# EAGLE schematic mr_radar (EAGLE 5.11)
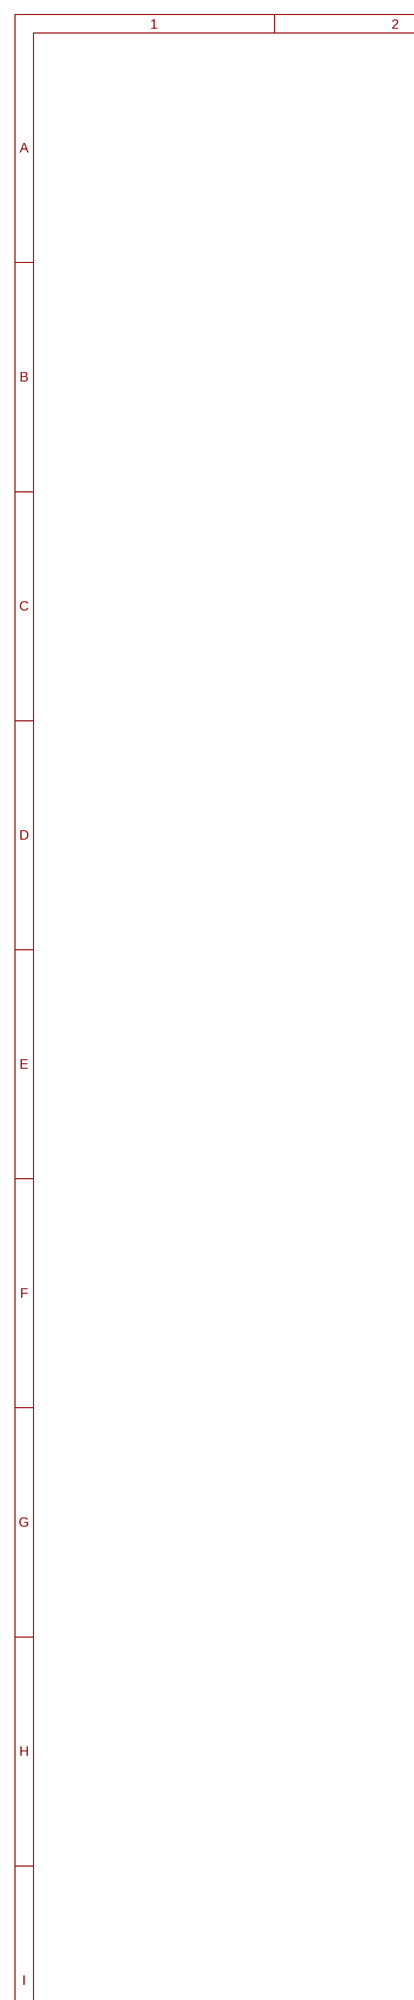
[diagram p0: schematic, sheet 1, part 1 of 2]
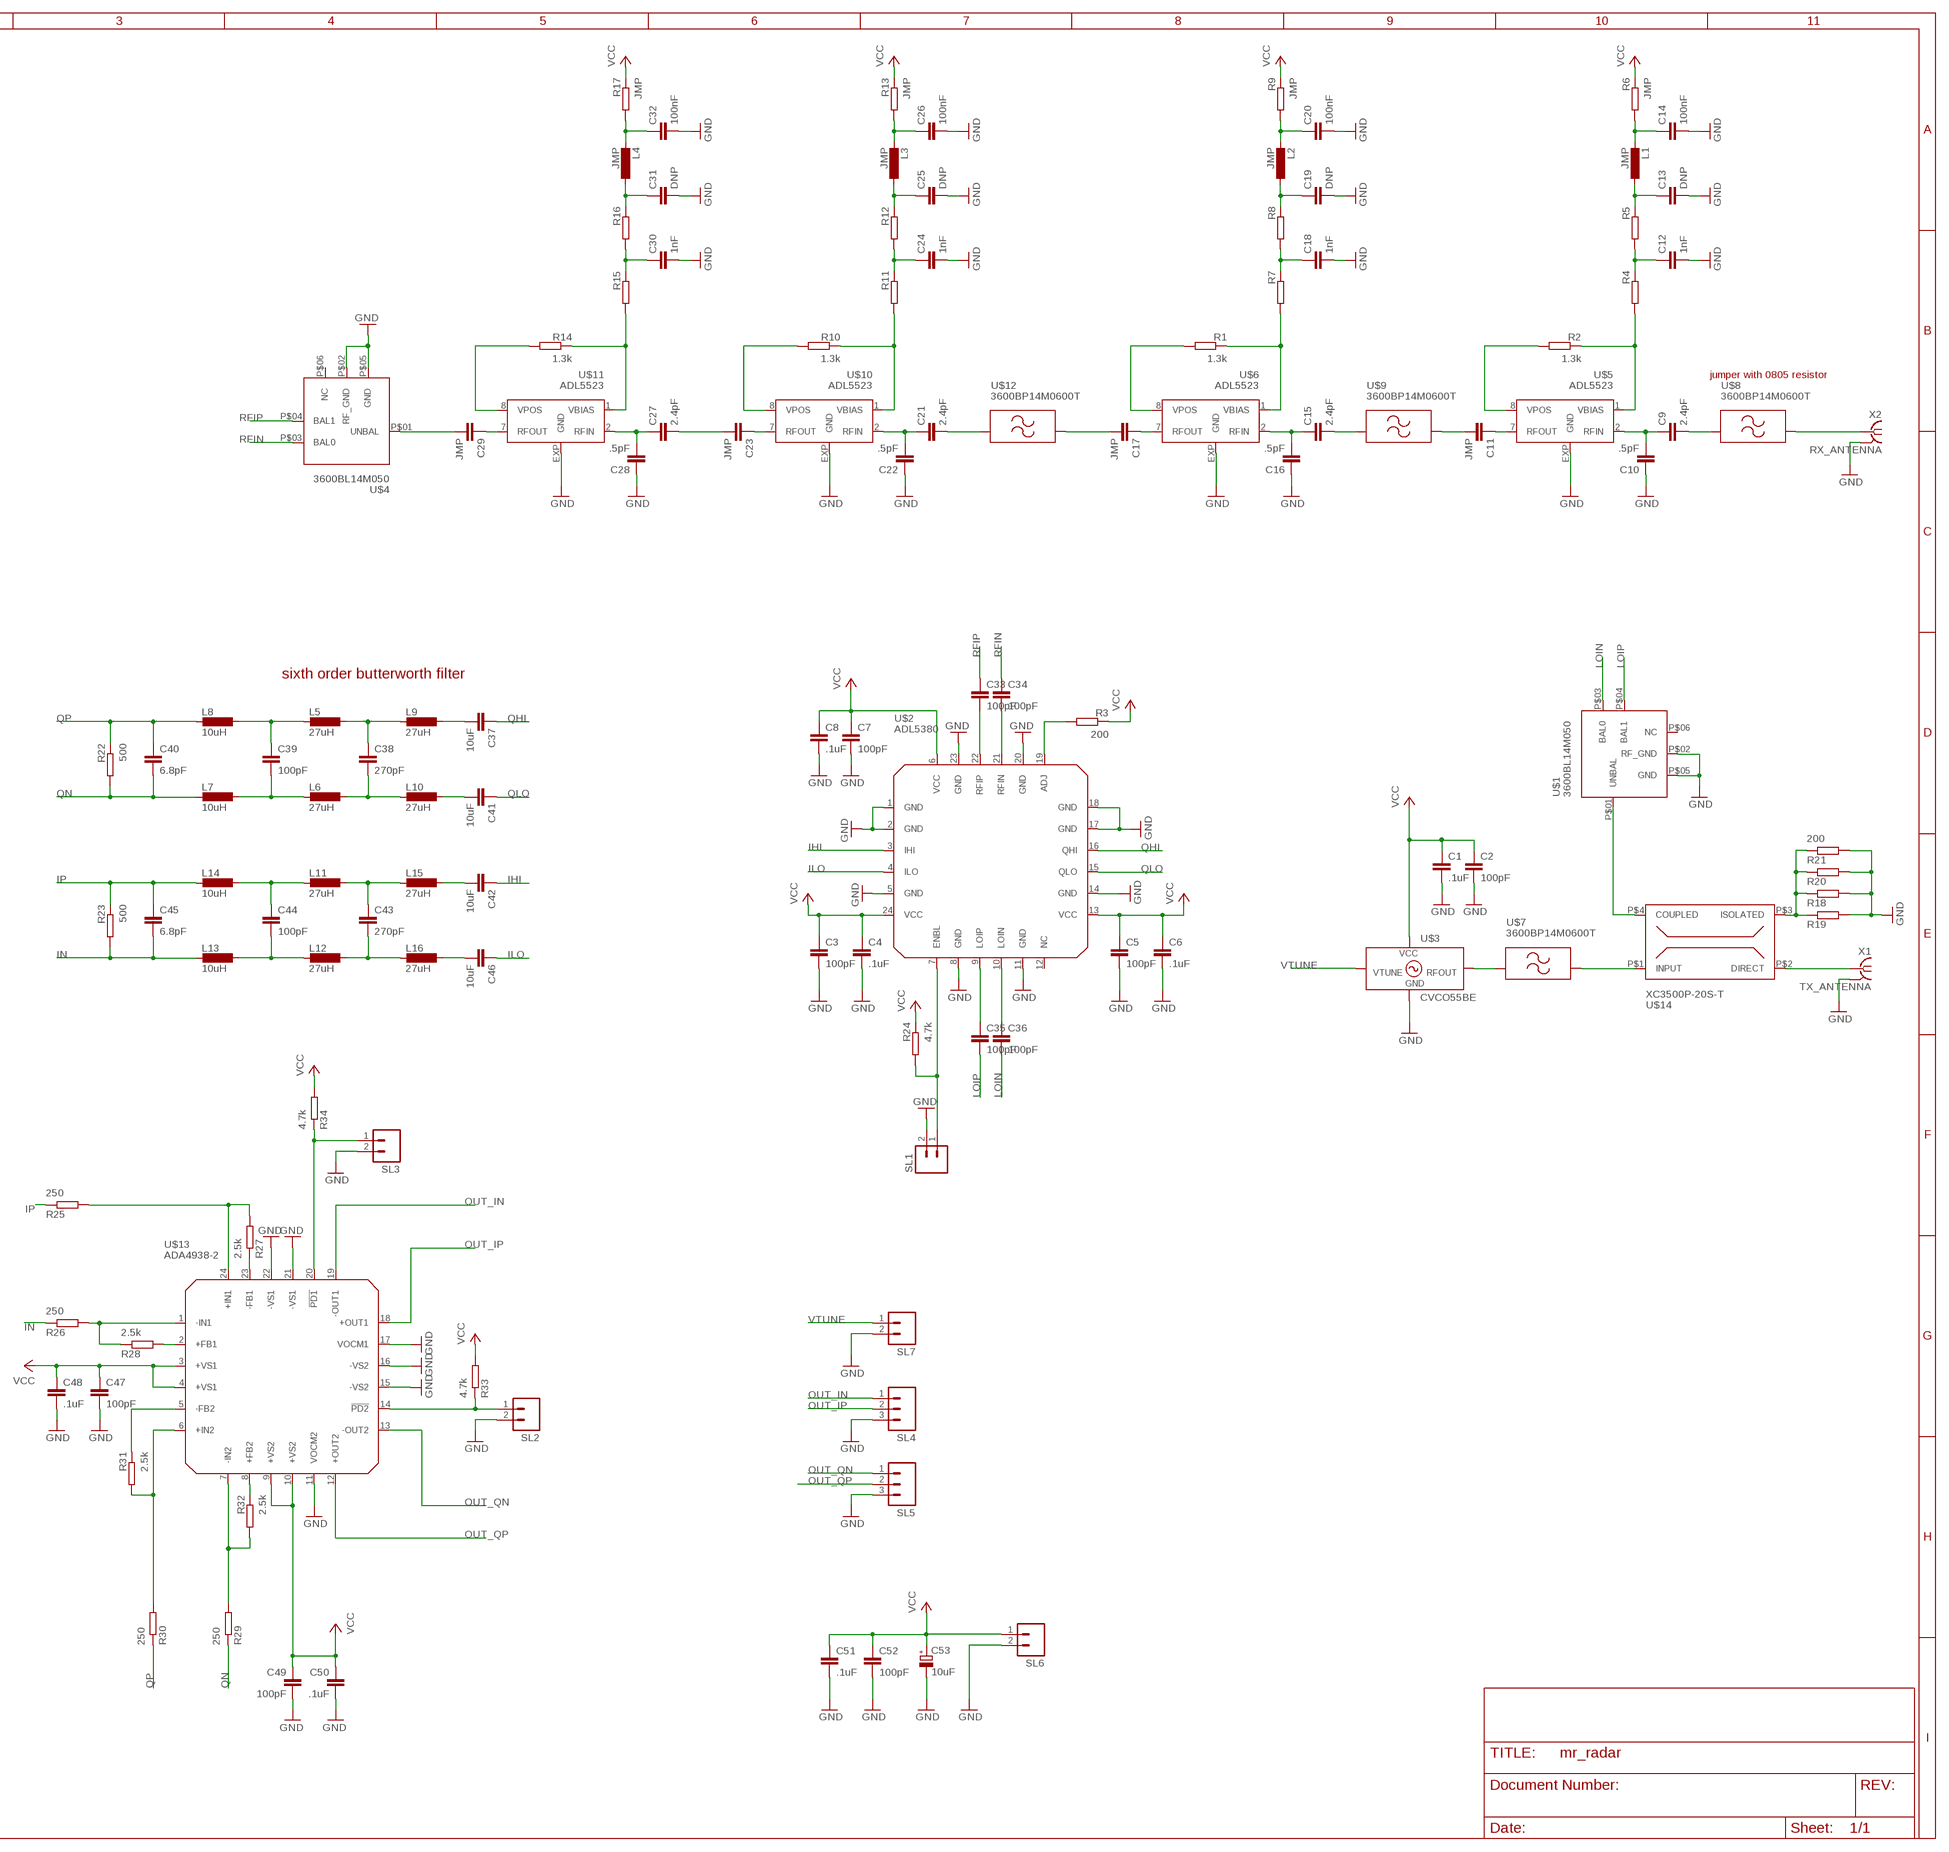
[diagram p1: schematic, sheet 1, part 2 of 2]

## Parts
C1  .1uF  CAPACITOR-0603  [0603-CAP]
C2  100pF  CAPACITOR-0603  [0603-CAP]
C3  100pF  CAPACITOR-0603  [0603-CAP]
C4  .1uF  CAPACITOR-0603  [0603-CAP]
C5  100pF  CAPACITOR-0603  [0603-CAP]
C6  .1uF  CAPACITOR-0603  [0603-CAP]
C7  100pF  CAPACITOR-0603  [0603-CAP]
C8  .1uF  CAPACITOR-0603  [0603-CAP]
C9  2.4pF  CAPACITOR-0402  [0402-CAP]
C10  .5pF  CAPACITOR-0402  [0402-CAP]
C11  JMP  CAPACITOR-0402  [0402-CAP]
C12  1nF  CAPACITOR-0402  [0402-CAP]
C13  DNP  CAPACITOR-0402  [0402-CAP]
C14  100nF  CAPACITOR-0402  [0402-CAP]
C15  2.4pF  CAPACITOR-0402  [0402-CAP]
C16  .5pF  CAPACITOR-0402  [0402-CAP]
C17  JMP  CAPACITOR-0402  [0402-CAP]
C18  1nF  CAPACITOR-0402  [0402-CAP]
C19  DNP  CAPACITOR-0402  [0402-CAP]
C20  100nF  CAPACITOR-0402  [0402-CAP]
C21  2.4pF  CAPACITOR-0402  [0402-CAP]
C22  .5pF  CAPACITOR-0402  [0402-CAP]
C23  JMP  CAPACITOR-0402  [0402-CAP]
C24  1nF  CAPACITOR-0402  [0402-CAP]
C25  DNP  CAPACITOR-0402  [0402-CAP]
C26  100nF  CAPACITOR-0402  [0402-CAP]
C27  2.4pF  CAPACITOR-0402  [0402-CAP]
C28  .5pF  CAPACITOR-0402  [0402-CAP]
C29  JMP  CAPACITOR-0402  [0402-CAP]
C30  1nF  CAPACITOR-0402  [0402-CAP]
C31  DNP  CAPACITOR-0402  [0402-CAP]
C32  100nF  CAPACITOR-0402  [0402-CAP]
C33  100pF  CAPACITOR-0603  [0603-CAP]
C34  100pF  CAPACITOR-0603  [0603-CAP]
C35  100pF  CAPACITOR-0603  [0603-CAP]
C36  100pF  CAPACITOR-0603  [0603-CAP]
C37  10uF  CAPACITOR-0603  [0603-CAP]
C38  270pF  CAPACITOR-0603  [0603-CAP]
C39  100pF  CAPACITOR-0603  [0603-CAP]
C40  6.8pF  CAPACITOR-0603  [0603-CAP]
C41  10uF  CAPACITOR-0603  [0603-CAP]
C42  10uF  CAPACITOR-0603  [0603-CAP]
C43  270pF  CAPACITOR-0603  [0603-CAP]
C44  100pF  CAPACITOR-0603  [0603-CAP]
C45  6.8pF  CAPACITOR-0603  [0603-CAP]
C46  10uF  CAPACITOR-0603  [0603-CAP]
C47  100pF  CAPACITOR-0603  [0603-CAP]
C48  .1uF  CAPACITOR-0603  [0603-CAP]
C49  100pF  CAPACITOR-0603  [0603-CAP]
C50  .1uF  CAPACITOR-0603  [0603-CAP]
C51  .1uF  CAPACITOR-0603  [0603-CAP]
C52  100pF  CAPACITOR-0603  [0603-CAP]
C53  10uF  CAPACITOR-POL-0805  [0805-POL-CAP]
L1  JMP  INDUCTOR-0402  [0402-IND]
L2  JMP  INDUCTOR-0402  [0402-IND]
L3  JMP  INDUCTOR-0402  [0402-IND]
L4  JMP  INDUCTOR-0402  [0402-IND]
L5  27uH  INDUCTOR-0603  [0603-IND]
L6  27uH  INDUCTOR-0603  [0603-IND]
L7  10uH  INDUCTOR-0603  [0603-IND]
L8  10uH  INDUCTOR-0603  [0603-IND]
L9  27uH  INDUCTOR-0603  [0603-IND]
L10  27uH  INDUCTOR-0603  [0603-IND]
L11  27uH  INDUCTOR-0603  [0603-IND]
L12  27uH  INDUCTOR-0603  [0603-IND]
L13  10uH  INDUCTOR-0603  [0603-IND]
L14  10uH  INDUCTOR-0603  [0603-IND]
L15  27uH  INDUCTOR-0603  [0603-IND]
L16  27uH  INDUCTOR-0603  [0603-IND]
R1  1.3k  RESISTOR-0603  [0603-RES]
R2  1.3k  RESISTOR-0603  [0603-RES]
R3  200  RESISTOR-0603  [0603-RES]
R4  RESISTOR-0603  [0603-RES]
R5  RESISTOR-0603  [0603-RES]
R6  JMP  RESISTOR-0603  [0603-RES]
R7  RESISTOR-0603  [0603-RES]
R8  RESISTOR-0603  [0603-RES]
R9  JMP  RESISTOR-0603  [0603-RES]
R10  1.3k  RESISTOR-0603  [0603-RES]
R11  RESISTOR-0603  [0603-RES]
R12  RESISTOR-0603  [0603-RES]
R13  JMP  RESISTOR-0603  [0603-RES]
R14  1.3k  RESISTOR-0603  [0603-RES]
R15  RESISTOR-0603  [0603-RES]
R16  RESISTOR-0603  [0603-RES]
R17  JMP  RESISTOR-0603  [0603-RES]
R18  RESISTOR-0402  [0402-RES]
R19  RESISTOR-0402  [0402-RES]
R20  RESISTOR-0402  [0402-RES]
R21  200  RESISTOR-0402  [0402-RES]
R22  500  RESISTOR-0603  [0603-RES]
R23  500  RESISTOR-0603  [0603-RES]
R24  4.7k  RESISTOR-0603  [0603-RES]
R25  250  RESISTOR-0603  [0603-RES]
R26  250  RESISTOR-0603  [0603-RES]
R27  2.5k  RESISTOR-0603  [0603-RES]
R28  2.5k  RESISTOR-0603  [0603-RES]
R29  250  RESISTOR-0603  [0603-RES]
R30  250  RESISTOR-0603  [0603-RES]
R31  2.5k  RESISTOR-0603  [0603-RES]
R32  2.5k  RESISTOR-0603  [0603-RES]
R33  4.7k  RESISTOR-0603  [0603-RES]
R34  4.7k  RESISTOR-0603  [0603-RES]
SL1  M02  [02P]
SL2  M02  [02P]
SL3  M02  [02P]
SL4  M03  [03P]
SL5  M03  [03P]
SL6  M02  [02P]
SL7  M02  [02P]
U$1  3600BL14M050  [3600BL14M050]
U$2  ADL5380  [LFCSP24]
U$3  CVCO55BE  [CVCO55BE]
U$4  3600BL14M050  [3600BL14M050]
U$5  ADL5523  [LFCSP8]
U$6  ADL5523  [LFCSP8]
U$7  3600BP14M0600T  [3600BP14M0600T]
U$8  3600BP14M0600T  [3600BP14M0600T]
U$9  3600BP14M0600T  [3600BP14M0600T]
U$10  ADL5523  [LFCSP8]
U$11  ADL5523  [LFCSP8]
U$12  3600BP14M0600T  [3600BP14M0600T]
U$13  ADA4938-2  [LFCSP24]
U$14  XC3500P-20S-T  [XC3500P-20S-T]
X1  TX_ANTENNA  BU-SMA-V  [BU-SMA-V]
X2  RX_ANTENNA  BU-SMA-V  [BU-SMA-V]

## Nets
GND: C1.P$2 C2.P$2 C3.P$2 C4.P$2 C5.P$2 C6.P$2 C7.P$2 C8.P$2 C10.P$1 C12.P$2 C13.P$2 C14.P$2 C16.P$1 C18.P$2 C19.P$2 C20.P$2 C22.P$1 C24.P$2 C25.P$2 C26.P$2 C28.P$1 C30.P$2 C31.P$2 C32.P$2 C47.P$2 C48.P$2 C49.P$2 C50.P$2 C51.P$2 C52.P$2 C53.- R18.P$2 R19.P$2 R20.P$2 R21.P$2 SL1.2 SL2.2 SL3.2 SL4.3 SL5.3 SL6.2 SL7.2 U$1.P$02(RF_GND) U$1.P$05(GND) U$2.1(GND) U$2.2(GND) U$2.5(GND) U$2.8(GND) U$2.11(GND) U$2.14(GND) U$2.17(GND) U$2.18(GND) U$2.20(GND) U$2.23(GND) U$3.P$1(GND) U$4.P$02(RF_GND) U$4.P$05(GND) U$5.EXP(GND) U$6.EXP(GND) U$10.EXP(GND) U$11.EXP(GND) U$13.11(VOCM2) U$13.15(-VS2) U$13.16(-VS2) U$13.17(VOCM1) U$13.21(-VS1) U$13.22(-VS1) X1.2(GND) X2.2(GND)
IHI: C42.P$1 U$2.3(IHI)
ILO: C46.P$1 U$2.4(ILO)
IN: C45.P$2 L13.P$2 R23.P$2 R26.P$1
IP: C45.P$1 L14.P$2 R23.P$1 R25.P$1
LOIN: C36.P$2 U$1.P$03(BAL0)
LOIP: C35.P$2 U$1.P$04(BAL1)
N$1: C11.P$2 U$9.P$2
N$2: R3.P$2 U$2.19(ADJ)
N$3: U$3.P$RFOUT(RFOUT) U$7.P$1
N$4: U$7.P$2 U$14.P$1(INPUT)
N$5: R1.P$1 R7.P$2 U$6.1(VBIAS)
N$6: U$14.P$2(DIRECT) X1.1
N$7: R2.P$1 R4.P$2 U$5.1(VBIAS)
N$8: C9.P$1 C10.P$2 U$5.2(RFIN)
N$9: C9.P$2 U$8.P$1
N$10: U$8.P$2 X2.1
N$11: R2.P$2 U$5.8(VPOS)
N$12: C11.P$1 U$5.7(RFOUT)
N$13: C13.P$1 L1.P$1 R5.P$1
N$14: C12.P$1 R4.P$1 R5.P$2
N$15: C14.P$1 L1.P$2 R6.P$2
N$16: C15.P$1 C16.P$2 U$6.2(RFIN)
N$17: C15.P$2 U$9.P$1
N$18: R1.P$2 U$6.8(VPOS)
N$19: C17.P$1 U$6.7(RFOUT)
N$20: C19.P$1 L2.P$1 R8.P$1
N$21: C18.P$1 R7.P$1 R8.P$2
N$22: C20.P$1 L2.P$2 R9.P$2
N$23: R10.P$1 R11.P$2 U$10.1(VBIAS)
N$24: C21.P$1 C22.P$2 U$10.2(RFIN)
N$25: C21.P$2 U$12.P$1
N$26: R10.P$2 U$10.8(VPOS)
N$27: C23.P$1 U$10.7(RFOUT)
N$28: C25.P$1 L3.P$1 R12.P$1
N$29: C24.P$1 R11.P$1 R12.P$2
N$30: C26.P$1 L3.P$2 R13.P$2
N$31: R14.P$1 R15.P$2 U$11.1(VBIAS)
N$32: C27.P$1 C28.P$2 U$11.2(RFIN)
N$33: C23.P$2 C27.P$2
N$34: R14.P$2 U$11.8(VPOS)
N$35: C29.P$1 U$11.7(RFOUT)
N$36: C31.P$1 L4.P$1 R16.P$1
N$37: C30.P$1 R15.P$1 R16.P$2
N$38: C32.P$1 L4.P$2 R17.P$2
N$39: C17.P$2 U$12.P$2
N$40: C33.P$2 U$2.22(RFIP)
N$41: R18.P$1 R19.P$1 R20.P$1 R21.P$1 U$14.P$3(ISOLATED)
N$42: C34.P$2 U$2.21(RFIN)
N$43: C29.P$2 U$4.P$01(UNBAL)
N$44: U$1.P$01(UNBAL) U$14.P$4(COUPLED)
N$45: C35.P$1 U$2.9(LOIP)
N$46: C36.P$1 U$2.10(LOIN)
N$47: C37.P$2 L9.P$1
N$48: C41.P$2 L10.P$1
N$49: C38.P$1 L5.P$1 L9.P$2
N$50: C38.P$2 L6.P$1 L10.P$2
N$51: C39.P$1 L5.P$2 L8.P$1
N$52: C39.P$2 L6.P$2 L7.P$1
N$53: C42.P$2 L15.P$1
N$54: C46.P$2 L16.P$1
N$55: C43.P$1 L11.P$1 L15.P$2
N$56: C43.P$2 L12.P$1 L16.P$2
N$57: C44.P$1 L11.P$2 L14.P$1
N$58: C44.P$2 L12.P$2 L13.P$1
N$59: R26.P$2 R28.P$1 U$13.1(-IN1)
N$60: R28.P$2 U$13.2(+FB1)
N$61: R30.P$2 R31.P$2 U$13.6(+IN2)
N$62: R24.P$2 SL1.1 U$2.7(ENBL)
N$63: R29.P$2 R32.P$2 U$13.7(-IN2)
N$64: R27.P$1 U$13.23(-FB1)
N$65: R32.P$1 U$13.8(+FB2)
N$67: R25.P$2 R27.P$2 U$13.24(+IN1)
N$68: R31.P$1 U$13.5(-FB2)
N$69: R33.P$1 SL2.1 U$13.14(!PD2)
N$70: R34.P$1 SL3.1 U$13.20(!PD1)
OUT_IN: SL4.1 U$13.19(-OUT1)
OUT_IP: SL4.2 U$13.18(+OUT1)
OUT_QN: SL5.1 U$13.13(-OUT2)
OUT_QP: SL5.2 U$13.12(+OUT2)
QHI: C37.P$1 U$2.16(QHI)
QLO: C41.P$1 U$2.15(QLO)
QN: C40.P$2 L7.P$2 R22.P$2 R29.P$1
QP: C40.P$1 L8.P$2 R22.P$1 R30.P$1
RFIN: C34.P$1 U$4.P$03(BAL0)
RFIP: C33.P$1 U$4.P$04(BAL1)
VCC: C1.P$1 C2.P$1 C3.P$1 C4.P$1 C5.P$1 C6.P$1 C7.P$1 C8.P$1 C47.P$1 C48.P$1 C49.P$1 C50.P$1 C51.P$1 C52.P$1 C53.+ R3.P$1 R6.P$1 R9.P$1 R13.P$1 R17.P$1 R24.P$1 R33.P$2 R34.P$2 SL6.1 U$2.6(VCC) U$2.13(VCC) U$2.24(VCC) U$3.P$VCC(VCC) U$13.3(+VS1) U$13.4(+VS1) U$13.9(+VS2) U$13.10(+VS2)
VTUNE: SL7.1 U$3.P$VT(VTUNE)
Unconnected: U$1.P$06(NC) U$2.12(NC) U$4.P$06(NC) U$5.3 U$5.4 U$5.5 U$5.6 U$6.3 U$6.4 U$6.5 U$6.6 U$10.3 U$10.4 U$10.5 U$10.6 U$11.3 U$11.4 U$11.5 U$11.6

## Notes on the sheet
- jumper with 0805 resistor
- sixth order butterworth filter

## Power pins joined to a net without a drawn wire
GND: U$2.EXP(GND) U$3.P$3(GND) U$3.P$4(GND) U$3.P$5(GND) U$3.P$6(GND) U$3.P$8(GND) U$3.P$9(GND) U$3.P$10(GND) U$3.P$11(GND) U$3.P$12(GND) U$3.P$13(GND) U$3.P$15(GND) U$3.P$16(GND) U$7.P$GND0(GND) U$7.P$GND1(GND) U$8.P$GND0(GND) U$8.P$GND1(GND) U$9.P$GND0(GND) U$9.P$GND1(GND) U$12.P$GND0(GND) U$12.P$GND1(GND) U$13.EXP(GND) X1.3(GND) X1.4(GND) X1.5(GND) X2.3(GND) X2.4(GND) X2.5(GND)

## Library data of the parts
C1-C52 = pel_dipol_comp:CAPACITOR
C53 = pel_dipol_comp:CAPACITOR-POL
L1-L16 = pel_dipol_comp:INDUCTOR
R1-R34 = pel_dipol_comp:RESISTOR
SL1-SL3 SL6 SL7 = con-amp-quick:M02: AMP QUICK CONNECTOR; OC_FARNELL: unknown; OC_NEWARK: unknown
SL4 SL5 = con-amp-quick:M03: AMP QUICK CONNECTOR; OC_FARNELL: unknown; OC_NEWARK: unknown
U$1 U$4 = mr_radar:3600BL14M050
U$2 = mr_radar:ADL5380
U$3 = mr_radar:CVCO55BE
U$5 U$6 U$10 U$11 = mr_radar:ADL5523
U$7-U$9 U$12 = mr_radar:3600BP14M0600T
U$13 = mr_radar:ADA4938-2
U$14 = mr_radar:XC3500P-20S-T
X1 X2 = con-coax:BU-SMA-V: FEMALE SMA CONNECTOR Radiall distributor RS 112-3794; OC_FARNELL: unknown; OC_NEWARK: unknown